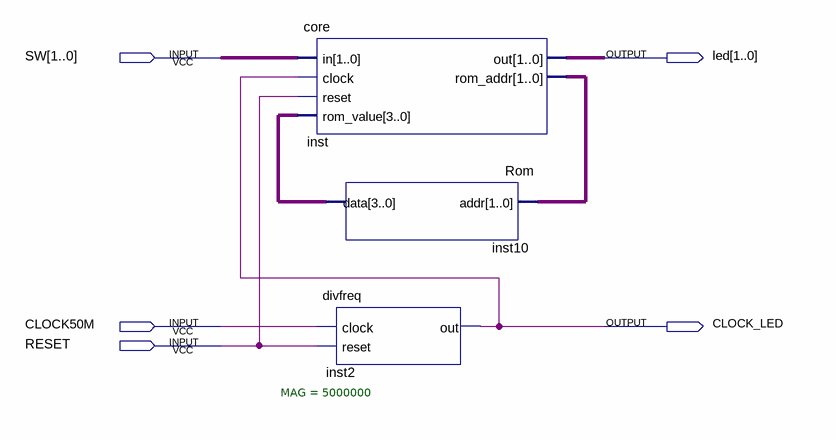
[diagram p0: schematic sheet]
// Quartus schematic top.bdf as structural Verilog: 3 symbols, 5 pins
module top (
  input  [1:0] SW,
  input  CLOCK50M,
  input  RESET,
  output [1:0] led,
  output CLOCK_LED
);

  wire [1:0] inst_rom_addr;
  wire [3:0] inst10_data;

  core inst (.in(SW), .clock(CLOCK_LED), .reset(RESET), .rom_value(inst10_data), .out(led), .rom_addr(inst_rom_addr));
  Rom inst10 (.addr(inst_rom_addr), .data(inst10_data));
  divfreq #(.MAG(5000000)) inst2 (.clock(CLOCK50M), .reset(RESET), .out(CLOCK_LED));
endmodule
